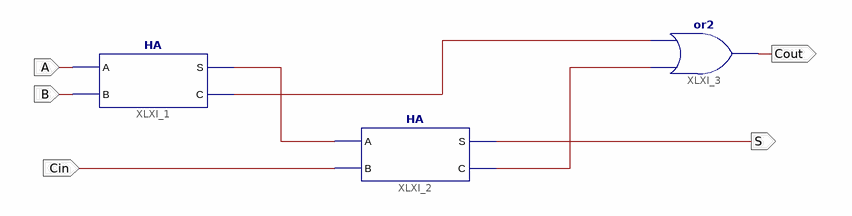
[diagram p0: schematic sheet 1]
// Xilinx ISE schematic FA.sch (spartan3e) as structural Verilog: 3 symbols, 5 ports
module FA (
  input  Cin,
  input  A,
  input  B,
  output S,
  output Cout
);

  wire XLXN_1, XLXN_2, XLXN_3;

  HA XLXI_1 (.A(A), .B(B), .C(XLXN_2), .S(XLXN_1));
  HA XLXI_2 (.A(XLXN_1), .B(Cin), .C(XLXN_3), .S(S));
  or XLXI_3 (Cout, XLXN_3, XLXN_2);
endmodule
